# EAGLE design untitled (EAGLE 9.3.0)
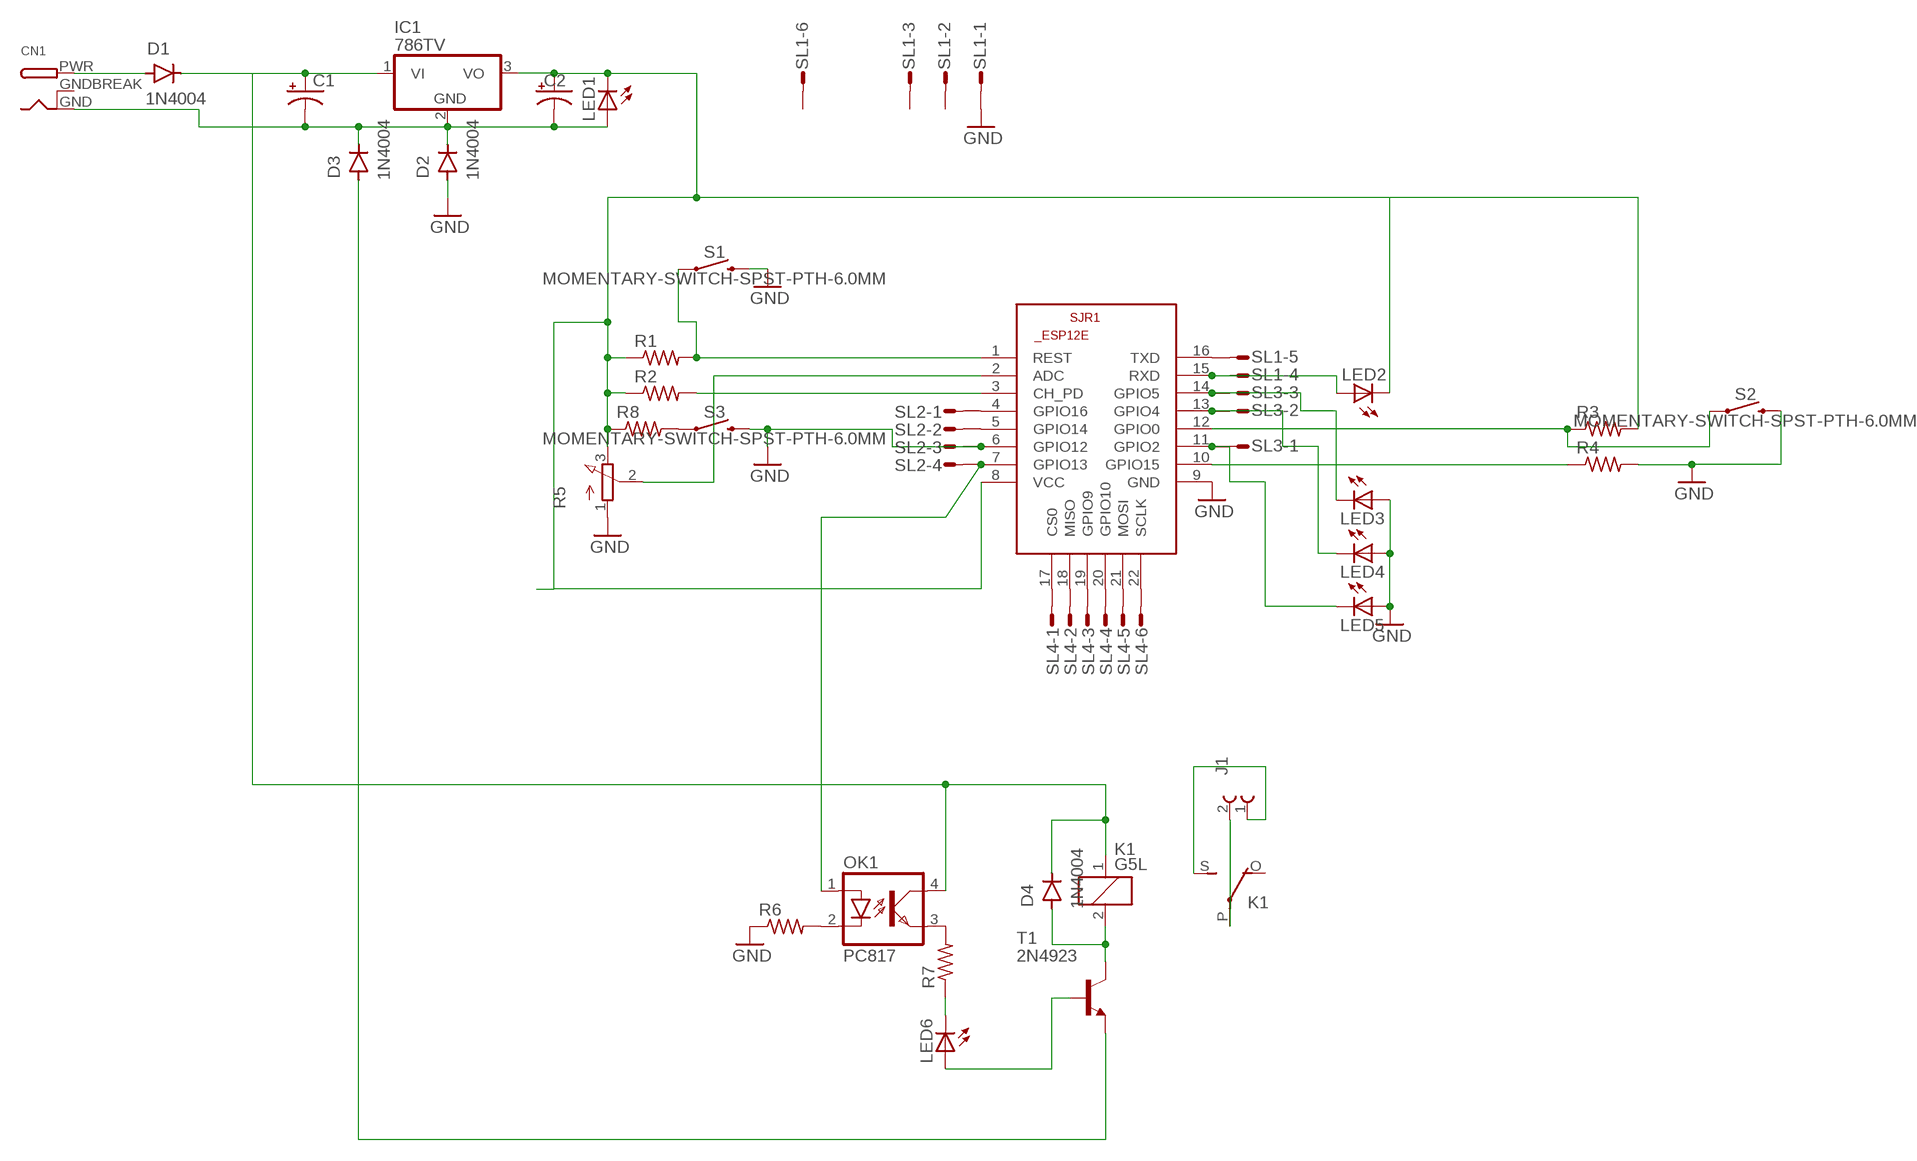
[diagram p0: schematic, sheet 1]

## Parts
C1  CAPACITOR-PE3.5-8  [E3,5-8]
C2  CAPACITOR-PE3.5-8  [E3,5-8]
CN1  DCBARRELPTH  [DCJACK_2MM_PTH]
D1  1N4004  [DO-41]
D2  1N4004  [DO-41]
D3  1N4004  [DO-41]
D4  1N4004  [DO-41]
IC1  786TV  [TO220V]
J1  691370710002B  [691370710002B]
K1  G5L  [G5LE]
LED1  LED5MM  [LED5MM]
LED2  LED5MM  [LED5MM]
LED3  LED5MM  [LED5MM]
LED4  LED5MM  [LED5MM]
LED5  LED5MM  [LED5MM]
LED6  LED5MM  [LED5MM]
OK1  PC817  [DIL04]
R1  R-US_0309/10  [0309/10]
R2  R-US_0309/10  [0309/10]
R3  R-US_0309/10  [0309/10]
R4  R-US_0309/10  [0309/10]
R5  3RP/1610N  [3RP/1610N]
R6  R-US_0309/10  [0309/10]
R7  R-US_0309/10  [0309/10]
R8  R-US_0309/10  [0309/10]
S1  MOMENTARY-SWITCH-SPST-PTH-6.0MM  [TACTILE_SWITCH_PTH_6.0MM]
S2  MOMENTARY-SWITCH-SPST-PTH-6.0MM  [TACTILE_SWITCH_PTH_6.0MM]
S3  MOMENTARY-SWITCH-SPST-PTH-6.0MM  [TACTILE_SWITCH_PTH_6.0MM]
SJR1  ESP8266-12EESP12E  [ESP8266-ESP12E]
SL1  M06S  [06P]
SL2  M04S  [04P]
SL3  M03S  [03P]
SL4  M06S  [06P]
T1  2N4923  [TO126]

## Nets
GND: D2.A LED3.A LED4.A LED5.A R4.2 R5.1(A) R6.1 S1.3 S2.3 S3.3 SJR1.6(GPIO12) SJR1.9(GND) SL1.1 SL2.3
N$1: CN1.PWR D1.A
N$2: C1.+ D1.C D4.C IC1.1(VI) K1.1 OK1.4(COL)
N$3: C1.- C2.- CN1.GND D2.C D3.C IC1.2(GND) LED1.A
N$4: C2.+ IC1.3(VO) LED1.K(C) LED2.K(C) R1.1 R2.1 R3.2 R5.3(E) R8.1 SJR1.8(VCC)
N$5: R3.1 S2.1 SJR1.12(GPIO0)
N$6: R2.2 SJR1.3(CH_PD)
N$7: R1.2 S1.1 SJR1.1(REST)
N$8: R4.1 SJR1.10(GPIO15)
N$9: SJR1.16(TXD) SL1.5
N$10: LED2.A SJR1.15(RXD) SL1.4
N$11: R5.2(S) SJR1.2(ADC)
N$12: SJR1.4(GPIO16) SL2.1
N$13: SJR1.5(GPIO14) SL2.2
N$15: OK1.1(A) SJR1.7(GPIO13) SL2.4
N$16: LED3.K(C) SJR1.14(GPIO5) SL3.3
N$17: LED4.K(C) SJR1.13(GPIO4) SL3.2
N$18: LED5.K(C) SJR1.11(GPIO2) SL3.1
N$19: SJR1.17(CS0) SL4.1
N$20: SJR1.18(MISO) SL4.2
N$21: SJR1.19(GPIO9) SL4.3
N$22: SJR1.20(GPIO10) SL4.4
N$23: SJR1.21(MOSI) SL4.5
N$24: SJR1.22(SCLK) SL4.6
N$25: OK1.2(C) R6.2
N$26: OK1.3(EMIT) R7.2
N$27: D3.A T1.1(E)
N$28: LED6.K(C) R7.1
N$29: LED6.A T1.3(B)
N$30: J1.2 K1.P(2:P)
N$31: D4.A K1.2 T1.2(C)
N$32: J1.1 K1.S(2:S)
N$33: R8.2 S3.1
Unconnected: K1.O(2:O) SL1.2 SL1.3 SL1.6

## Power pins joined to a net without a drawn wire
GNDBREAK: CN1.GNDBREAK

## Library data of the parts
C1 C2 = BeagleBone_Blue_R3:CAPACITOR-P: POLARIZED CAPACITOR, American symbol
CN1 = adafruit:DCBARREL: 2.0mm DC Barrel Jack DCJACK_2MM_PTH - Through Hole Jack (4UConnector: 05537)
D1-D4 = Diodes:1N4004: DIODE GEN PURP 400V 1A DO41 Manufacturer's datasheet <https://www.mccsemi.com/pdf/Products/1N4001-1N4007(DO-41).pdf>; CREATED_BY: PCBLayout.com; DIGIKEY_PART_NUMBER: 1N4004MSCT-ND; MANUFACTURER: Micro Commercial Co; MPN: 1N4004; PACKAGE: DO-41
IC1 = linear:78*: Positive VOLTAGE REGULATOR Source: http://cache.national.com/ds/LM/LM78L05.pdf http://www.fairchildsemi.com/ds/LM/LM7805.pdf
J1 = Wurth_Elektronik_Electromechanic_Terminal_Blocks_Connectors_rev19b:691370710002B: WR-TBL Terminal block - serie 370B-5,00mm - PCB Horizontal with strong retention force between male and female housing - grey - 2 Pins=>Code : Con_TBL_Pluggable_5.00_PCB_H_691370710002B <http://katalog.we-online.de/media/images/eican/Con_TBL_Pluggable_5.00_PCB_H_6913707100xxB_pf2.jpg> Details see: http://katalog.we-online.de/en/em/TBL_5_00_370B_HORIZONTAL_MALE_PCB_HEADER_69137071000XB Created 2014-06-20, Karrer Zheng 2014 (C) Würth Elektronik
K1 = relay:G5L: RELAY 1 x switch, 10 A/120 V AC, 8 A/30 V ADC, Omron; OC_FARNELL: unknown; OC_NEWARK: unknown
LED1-LED6 = adafruit:LED: LED OSRAM: - CHIPLED LG R971, LG N971, LY N971, LG Q971, LY Q971, LO R971, LY R971 LH N974, LH R974 LS Q976, LO Q976, LY Q976 LO Q996 - Hyper CHIPLED LW Q18S LB Q993, LB Q99A, LB R99A - SideLED LS A670, LO A670, LY A670, LG A670, LP A670 LB A673, LV A673, LT A673, LW A673 LH A674 LY A675 LS A676, LA A676, LO A676, LY A676, LW A676 LS A679, LY A679, LG A679 - Hyper Micro SIDELED® LS Y876, LA Y876, LO Y876, LY Y876 LT Y87S - SmartLED LW L88C, LW L88S LB L89C, LB L89S, LG L890 LS L89K, LO L89K, LY L89K LS L896, LA L896, LO L896, LY L896 - TOPLED LS T670, LO T670, LY T670, LG T670, LP T670 LSG T670, LSP T670, LSY T670, LOP T670, LYG T670 LG T671, LOG T671, LSG T671 LB T673, LV T673, LT T673, LW T673 LH T674 LS T676, LA T676, LO T676, LY T676, LB T676, LH T676, LSB T676, LW T676 LB T67C, LV T67C, LT T67C, LS T67K, LO T67K, LY T67K, LW E67C LS E67B, LA E67B, LO E67B, LY E67B, LB E67C, LV E67C, LT E67C LW T67C LS T679, LY T679, LG T679 LS T770, LO T770, LY T770, LG T770, LP T770 LB T773, LV T773, LT T773, LW T773 LH T774 LS E675, LA E675, LY E675, LS T675 LS T776, LA T776, LO T776, LY T776, LB T776 LHGB T686 LT T68C, LB T68C - Hyper Mini TOPLED® LB M676 - Mini TOPLED Santana® LG M470 LS M47K, LO M47K, LY M47K Source: http://www.osram.convergy.de/
OK1 = optocoupler:PC817: SHARP OPTO COUPLER; MPN: PC817X4J000F; OC_FARNELL: 9707727; OC_NEWARK: 97K7059
R1-R4 R6-R8 = BeagleBone_Black_Wireless:R-US_: RESISTOR, American symbol
R5 = pot:3RP/1610N: 16mm Potentiometer one level Source: http://www.alphapotentiometers.net/html/16mm_pot_2.html
S1-S3 = SparkFun-Switches:MOMENTARY-SWITCH-SPST: Momentary Switch (Pushbutton) - SPST Normally-open (NO) SPST momentary switches (buttons, pushbuttons). Variants PTH-12MM - 12mm square, through-hole Momentary Pushbutton Switch - 12mm Square <https://www.sparkfun.com/products/9190> (COM-09190) PTH-6.0MM, PTH-6.0MM-KIT - 6.0mm square, through-hole Mini Pushbutton Switch <https://www.sparkfun.com/products/97> (COM-00097) KIT package intended for soldering kit's - only one side of pads' copper is exposed. PTH-RIGHT-ANGLE-KIT - Right-angle, through-hole Right Angle Tactile Button <https://www.sparkfun.com/products/10791> - Used on SparkFun BigTime Watch Kit <https://www.sparkfun.com/products/11734> SMD-12MM - 12mm square, surface-mount Tactile Button - SMD (12mm) <https://www.sparkfun.com/products/12993> (COM-12993) Used on SparkFun PicoBoard <https://www.sparkfun.com/products/11888> SMD-4.5MM - 4.5mm Square Trackball Switch Used on SparkFun Blackberry Trackballer Breakout <https://www.sparkfun.com/products/13169> SMD-4.6MMX2.8MM - 4.60mm x 2.80mm, surface mount Used on SparkFun SAMD21 Mini Breakout <https://www.sparkfun.com/products/13664> SMD-5.2MM, SMD-5.2-REDUNDANT - 5.2mm square, surface-mount Mini Pushbutton Switch - SMD <https://www.sparkfun.com/products/8720> (COM-08720) Used on Arduino Pro Mini <https://www.sparkfun.com/products/11114> REDUNDANT package connects both switch circuits together SMD-6.0X3.5MM - 6.0 x 3.5mm, surface mount Momentary Reset Switch SMD <https://www.sparkfun.com/products/8229> (COM-08229) SMD-6.2MM-TALL - 6.2mm square, surface mount Tactile Button - SMD (6mm) <https://www.sparkfun.com/products/12992> Used on SparkFun Digital Sandbox <https://www.sparkfun.com/products/12651> SMD-RIGHT-ANGLE - Right-angle, surface mount Used on SparkFun Block for Intel® Edison - Arduino <https://www.sparkfun.com/products/13036>; PROD_ID: SWCH-08441; SF_SKU: COM-00097
SJR1 = esp12e:ESP8266-12E: ESP8266-12E Library for Eagle CAD The author not responsible for any damages or errors!. Created by Suhail jr.lt;/author>
SL1 SL4 = con-amp-quick:M06S: AMP QUICK CONNECTOR; OC_FARNELL: unknown; OC_NEWARK: unknown
SL2 = con-amp-quick:M04S: AMP QUICK CONNECTOR; OC_FARNELL: unknown; OC_NEWARK: unknown
SL3 = con-amp-quick:M03S: AMP QUICK CONNECTOR; OC_FARNELL: unknown; OC_NEWARK: unknown
T1 = transistor:2N4923: NPN TRANSISTOR

## Board
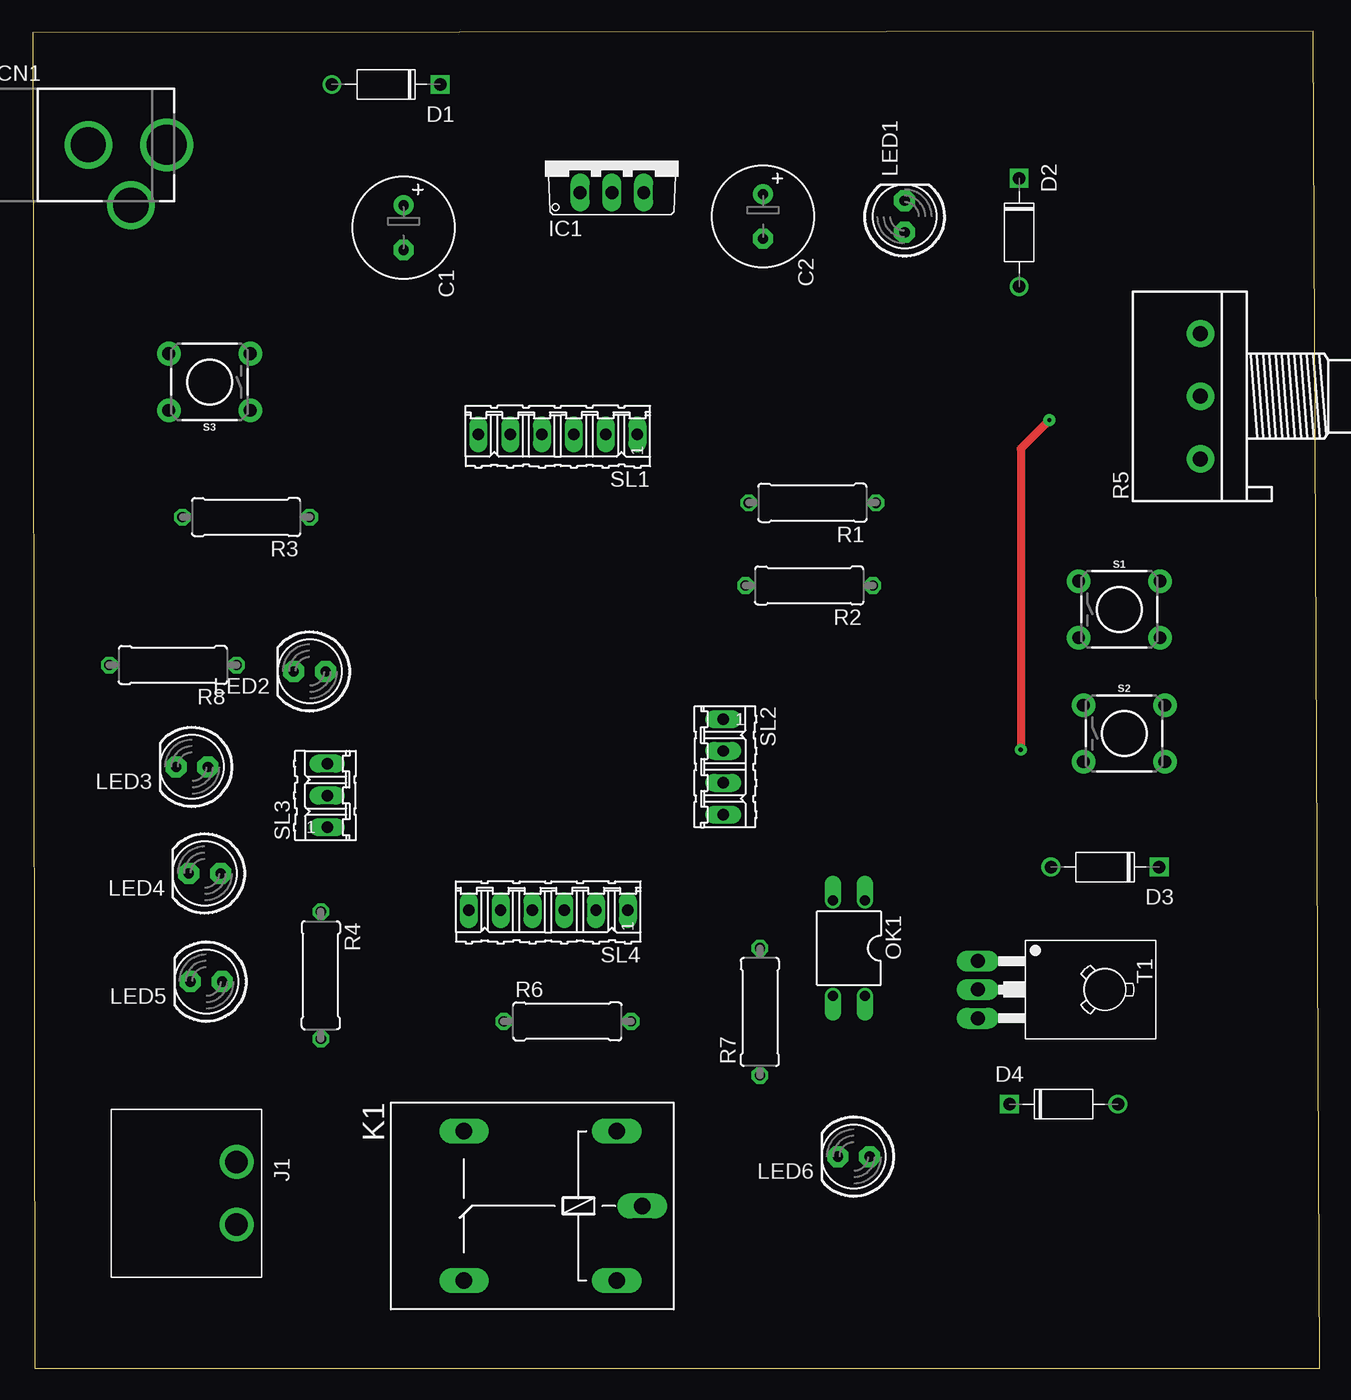
[diagram p1: board, top side]
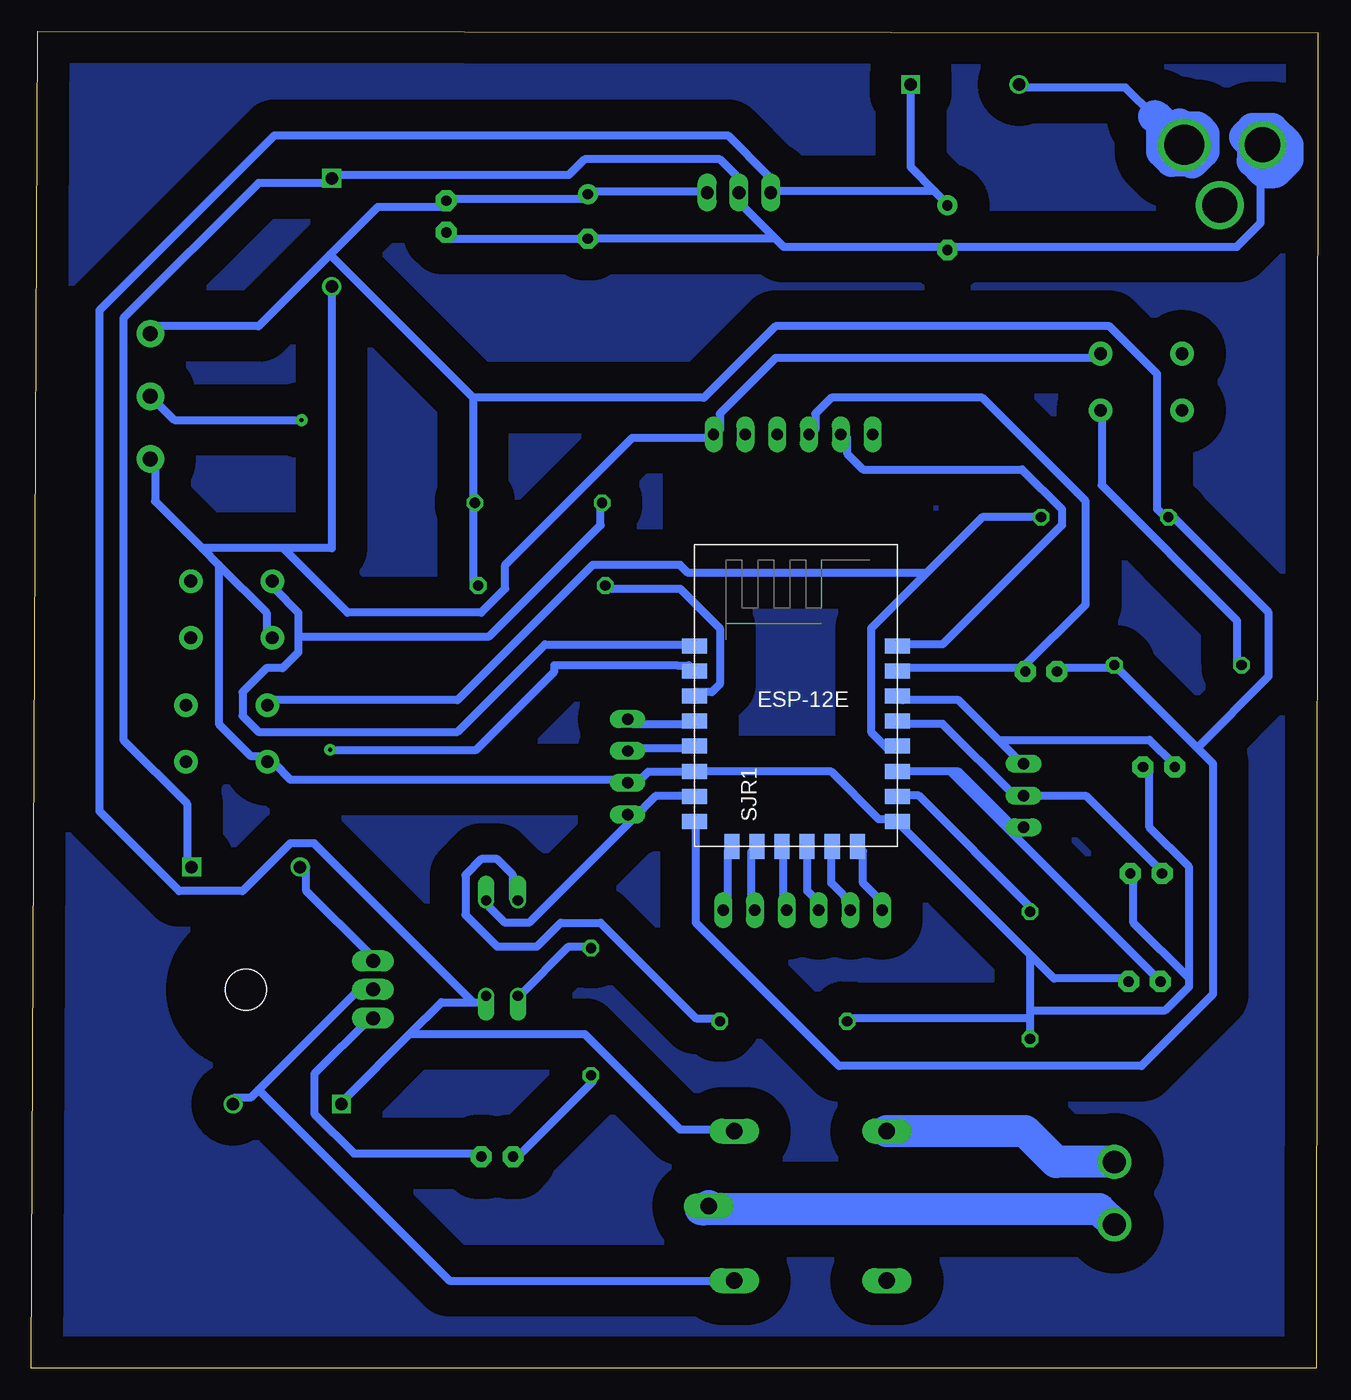
[diagram p2: board, bottom side, seen from below]

Size 102.72 x 106.73 mm. Coordinates in mm from the lower left corner, seen from the top.
Outline: 0.13,0 102.72,0 102.22,106.73 0,106.6 0.13,0
Copper layers (1*16): Top 0.035mm / dielectric 1.5mm / Bottom 0.035mm
Design rules "default *": minimum track width 25mil, minimum drill 0.35mm, track to track 30mil, track to pad 25mil, pad to pad 6mil, via to via 6mil, smd to smd 6mil, copper to edge 40mil, drill to drill 6mil, minimum pad ring 10mil, minimum via ring 8mil, stop-mask expansion 4mil, vias tented up to drill 0mil, thermal gap 10mil

### Footprints (pad centres in the part's own frame; a part is rotated, then mirrored left to right if it is on the bottom)
E3,5-8 = drill 0.813 pad 1.6: + -1.778,0 | drill 0.813 pad 1.6 octagon: - 1.778,0
DCJACK_2MM_PTH = drill 2.8: GND 0,7.35; GNDBREAK 4.8,10.75 | drill 3.2: PWR 0,13.6
DO-41 = drill 1: A 4.325,0 | drill 1 square: C -4.325,0
TO220V = drill 1.016 long: 1 -2.54,-2.54; 2 0,-2.54; 3 2.54,-2.54
691370710002B = drill 1.8: 1 -2.5,0; 2 2.5,0
G5LE = drill 1.321 long: 1 -7.493,-5.969; 2 -7.493,5.969; O 4.699,5.969; P -9.525,0; S 4.699,-5.969
LED5MM = drill 0.813 pad 1.676 octagon: A -1.27,0; K 1.27,0
DIL04 = drill 0.813 offset: 1 -1.27,-3.81; 2 1.27,-3.81; 3 1.27,3.81; 4 -1.27,3.81
0309/10 = drill 0.813 octagon: 1 -5.08,0; 2 5.08,0
3RP/1610N = drill 1.2 pad 2.184: 1 -5,0; 2 0,0; 3 5,0
TACTILE_SWITCH_PTH_6.0MM = drill 1.016 pad 1.88: 1 -3.251,2.261; 2 3.251,2.261; 3 -3.251,-2.261; 4 3.251,-2.261
ESP8266-ESP12E = smd 2 x 1.2: 1 -7.62,5.84; 2 -7.62,3.84; 3 -7.62,1.84; 4 -7.62,-0.16; 5 -7.62,-2.16; 6 -7.62,-4.16; 7 -7.62,-6.16; 8 -7.62,-8.16; 9 8.58,-8.16; 10 8.58,-6.16; 11 8.58,-4.16; 12 8.58,-2.16; 13 8.58,-0.16; 14 8.58,1.84; 15 8.58,3.84; 16 8.58,5.84 | smd 1.2 x 2: 17 -4.62,-10.16; 18 -2.62,-10.16; 19 -0.62,-10.16; 20 1.38,-10.16; 21 3.38,-10.16; 22 5.38,-10.16
06P = drill 0.914 long: 1 -6.35,0; 2 -3.81,0; 3 -1.27,0; 4 1.27,0; 5 3.81,0; 6 6.35,0
04P = drill 0.914 long: 1 -3.81,0; 2 -1.27,0; 3 1.27,0; 4 3.81,0
03P = drill 0.914 long: 1 -2.54,0; 2 0,0; 3 2.54,0
TO126 = drill 1.118 long: 1 -2.286,-5.08; 2 0,-5.08; 3 2.286,-5.08 | hole 3.302: 0,5.08

### Placement (x,y rotation side)
C1  29.59,91.06 270 top
C2  58.29,91.95 270 top
CN1  -2.92,97.66 270 top
D1  28.19,102.49 180 top
D2  78.74,90.68 270 top
D3  85.6,40 180 top
D4  82.3,21.08 0 top
IC1  46.23,96.39 0 top
J1  16.26,13.97 270 top
K1  39.12,12.95 180 top
LED1  69.6,91.95 90 top
LED2  22.1,55.63 180 top
LED3  12.7,48.01 180 top
LED4  13.72,39.5 180 top
LED5  13.84,30.86 180 top
LED6  65.53,16.89 180 top
OK1  65.15,33.53 180 top
R1  62.23,69.09 180 top
R2  61.98,62.48 180 top
R3  17.02,67.94 180 top
R4  22.99,31.37 270 top
R5  93.22,77.6 90 top
R6  42.67,27.69 0 top
R7  58.04,28.45 90 top
R8  11.18,56.13 180 top
S1  86.74,60.58 0 top
S2  87.12,50.67 0 top
S3  14.1,78.74 180 top
SJR1  42.16,51.82 0 bottom
SL1  41.91,74.55 180 top
SL2  55.12,48.01 270 top
SL3  23.5,45.72 90 top
SL4  41.15,36.58 180 top
T1  80.52,30.23 270 top

### Tracks (layer width: path | path; a pad name or v marks a point on that pad's centre or on a via)
GND
  Bottom 0.635: 22.99,33.02 21.08,31.11 15.37,31.11 LED5.A | 22.99,33.02 33.15,43.18 SJR1.9 33.78,43.81 35.05,43.81 38.86,47.62 49.66,47.62 SJR1.6 50.29,47.62 53.47,47.62 54.74,46.36 SL2.3 55.37,46.99 82.04,46.99 83.31,48.26 S2.3 83.95,48.89 85.22,48.89 87.76,51.44 87.76,64.14 | 22.99,33.02 22.99,28.57 | 22.99,28.57 22.99,27.94 | 22.99,27.94 R4.2 | 22.99,27.94 37.59,27.94 R6.1 | 10.29,31.11 14.73,35.56 14.73,39.37 LED4.A | 10.29,31.11 10.29,30.48 12.19,28.57 22.99,28.57 | 10.29,31.11 10.29,40 13.46,43.18 13.46,47.62 LED3.A | S3.3 17.91,80.64 43.31,80.64 47.75,76.2 47.75,74.93 SL1.1 48.39,74.3 54.74,74.3 64.9,64.14 64.9,62.23 66.8,60.33 77.47,60.33 82.61,65.47 | 92.84,73.03 R5.1 92.84,72.39 92.84,69.22 89.09,65.47 | 89.09,65.47 87.76,64.14 | 87.76,64.14 83.95,60.33 83.95,58.42 S1.3 | 82.61,65.47 78.74,65.47 D2.A | 82.61,65.47 89.09,65.47
N$1
  Bottom 0.635: 12.13,99 13.08,99.95 15.37,102.23 23.62,102.23 D1.A
  Bottom 2.54: 10.79,99.06 10.68,98.94 CN1.PWR 12.96,99.95 13.08,99.95 | 11.05,99.31 10.79,99.06 | 10.79,99.06 9.65,99.06 9.14,98.55 9.14,97.16 10.03,96.27 10.16,96.39 11.68,96.39 12.45,97.16 12.45,98.68 12.13,99
N$2
  Bottom 0.635: 30.61,93.98 29.97,93.34 C1.+ | 30.61,93.98 32.51,95.89 32.51,102.23 D1.C | 30.61,93.98 43.31,93.98 IC1.1 43.94,93.98 43.94,95.25 47.12,98.42 83.31,98.42 97.28,84.45 97.28,44.45 90.93,38.1 85.85,38.1 82.04,41.91 80.14,41.91 67.44,29.21 | 67.44,29.21 69.98,29.21 72.52,26.67 | 67.44,29.21 66.8,29.21 OK1.4 | 72.52,26.67 77.6,21.59 D4.C | 72.52,26.67 58.55,26.67 50.93,19.05 47.12,19.05 K1.1
N$3
  Bottom 0.635: LED1.A 69.34,90.17 C2.- 43.31,90.17 | D3.C 90.3,40 90.3,45.08 95.38,50.17 95.38,83.82 84.58,94.62 78.87,94.62 D2.C 78.23,95.25 59.82,95.25 58.55,96.52 47.75,96.52 46.48,95.25 46.48,93.98 IC1.2 46.48,93.34 43.31,90.17 | 43.31,90.17 42.67,89.53 29.97,89.53 C1.- 29.34,89.53 6.48,89.53 4.57,91.44 4.57,97.16 CN1.GND
  Bottom 2.54: 3.56,98.04 3.94,97.66 CN1.GND 4.43,96.5 3.43,95.5 | 3.43,95.5 2.41,96.52 2.41,97.66 3.68,98.93 5.21,98.93 5.84,98.3 5.21,97.66 5.21,96.39 4.32,95.5 3.43,95.5
N$4
  Bottom 0.635: R2.1 67.44,62.86 67.44,68.58 R1.1 67.44,69.22 67.44,77.47 | IC1.3 49.02,93.98 57.91,93.98 C2.+ 58.55,93.34 69.34,93.34 LED1.K 69.98,92.71 75.06,92.71 78.87,88.9 | 78.87,88.9 84.58,83.19 92.84,83.19 R5.3 | 78.87,88.9 67.44,77.47 | 9.65,49.53 R8.1 16.64,55.88 20.45,55.88 LED2.K | 9.65,49.53 8.38,48.26 8.38,29.84 14.1,24.13 38.23,24.13 49.66,35.56 49.66,43.18 SJR1.8 | 9.65,49.53 3.94,55.25 3.94,60.33 11.56,67.94 R3.2 12.19,67.94 12.83,68.58 12.83,79.38 16.64,83.19 43.31,83.19 49.02,77.47 67.44,77.47
N$5
  Bottom 0.635: 31.24,63.5 26.8,67.94 R3.1 | 31.24,63.5 35.69,59.05 35.69,50.8 34.42,49.53 33.78,49.53 SJR1.12 | 31.24,63.5 50.29,63.5 50.93,64.14 57.91,64.14 68.71,53.34 83.31,53.34 S2.1
N$6
  Bottom 0.635: SJR1.3 49.66,53.97 48.39,53.97 47.75,54.61 47.75,59.05 50.93,62.23 56.64,62.23 R2.2
N$7
  Bottom 0.635: 81.41,58.42 81.41,60.33 83.31,62.23 S1.1 | 81.41,58.42 81.41,57.15 82.68,55.88 83.95,55.88 85.85,53.97 85.85,52.07 84.58,50.8 68.71,50.8 61.72,57.78 50.29,57.78 SJR1.1 | 81.41,58.42 66.17,58.42 57.28,67.31 57.28,68.58 R1.2
N$8
  Bottom 0.635: SJR1.10 33.15,45.72 31.88,45.72 22.99,36.83 R4.1
N$9
  Bottom 0.635: SJR1.16 33.15,57.78 29.97,57.78 20.45,67.31 20.45,68.58 23.62,71.75 36.32,71.75 37.59,73.03 37.59,74.3 SL1.5
N$10
  Bottom 0.635: 23.62,55.88 33.15,55.88 SJR1.15 | 23.62,55.88 18.54,60.96 18.54,69.22 26.8,77.47 38.86,77.47 40.13,76.2 40.13,74.93 SL1.4 | 23.62,55.88 LED2.A
N$11  (via drill 0.35 pad 0.95)
  Top 0.635: v81.15,75.69 78.87,73.41 v78.87,49.37
  Bottom 0.635: R5.2 91.31,75.69 v81.15,75.69 | v78.87,49.37 67.21,49.37 60.96,55.63 60.96,56.13 51.21,56.13 51.18,56.1 50.23,56.1 SJR1.2
N$12
  Bottom 0.635: SJR1.4 50.29,51.44 54.74,51.44 SL2.1
N$13
  Bottom 0.635: SJR1.5 50.29,49.53 54.74,49.53 SL2.2
N$14
  pour Bottom (isolate 2.54): -0.13,106.55 101.98,106.55 102.11,106.68 102.11,0 0.25,0 0.13,0.13 0.13,106.43
N$15
  Bottom 0.635: 54.74,43.81 52.83,45.72 50.29,45.72 SJR1.7 | 54.74,43.81 62.99,35.56 64.9,35.56 66.17,36.83 OK1.1 | 54.74,43.81 SL2.4
N$16
  Bottom 0.635: 25.53,50.17 23.62,48.26 SL3.3 | 25.53,50.17 28.7,53.34 33.15,53.34 SJR1.14 | 25.53,50.17 13.46,50.17 11.56,48.26 LED3.K
N$17
  Bottom 0.635: SJR1.13 33.15,51.44 29.97,51.44 24.26,45.72 SL3.2 18.54,45.72 12.83,40 LED4.K
N$18
  Bottom 0.635: 29.34,47.62 28.7,47.62 24.26,43.18 SL3.1 | 29.34,47.62 33.15,47.62 SJR1.11 | 29.34,47.62 LED5.K
N$19
  Bottom 0.635: SJR1.17 47.12,41.27 47.12,36.83 SL4.1
N$20
  Bottom 0.635: SJR1.18 45.21,41.27 45.21,36.83 SL4.2
N$21
  Bottom 0.635: SJR1.19 42.67,41.27 42.67,36.83 SL4.3
N$22
  Bottom 0.635: SJR1.20 40.77,41.27 40.77,38.1 39.5,36.83 SL4.4
N$23
  Bottom 0.635: SJR1.21 38.86,41.27 38.86,38.73 36.96,36.83 SL4.5
N$24
  Bottom 0.635: SJR1.22 36.32,41.27 36.32,38.73 34.42,36.83 SL4.6
N$25
  Bottom 0.635: R6.2 47.75,27.94 49.66,27.94 57.28,35.56 60.45,35.56 62.36,33.66 65.53,33.66 68.07,36.2 68.07,39.37 66.8,40.64 65.53,40.64 64.26,39.37 64.26,37.47 OK1.2
N$26
  Bottom 0.635: R7.2 58.55,33.66 59.82,33.66 63.63,29.84 OK1.3
N$27
  Bottom 0.635: D3.A 80.77,40 80.77,38.1 75.69,33.02 T1.1
N$28
  Bottom 0.635: R7.1 57.91,22.86 64.26,16.51 LED6.K
N$29
  Bottom 0.635: LED6.A 66.8,17.14 76.96,17.14 80.14,20.32 80.14,23.49 75.69,27.94 T1.3
N$30
  Bottom 0.635: 17.27,12.7 16.64,12.06 J1.2
  Bottom 2.54: J1.2 17.49,12.7 48.9,12.7 | 49.28,12.7 48.9,12.7 | 48.9,12.7 K1.P
N$31
  Bottom 0.635: 84.58,22.23 76.96,29.84 75.69,29.84 T1.2 | 84.58,22.23 85.22,21.59 86.49,21.59 D4.A | K1.2 69.34,6.98 84.58,22.23
N$32
  Bottom 0.635: 16.64,16.51 J1.1
  Bottom 2.54: J1.1 20.91,16.47 23.37,18.92 K1.S
N$33
  Bottom 0.635: R8.2 6.48,56.52 6.48,59.69 17.27,70.48 17.27,76.2 S3.1